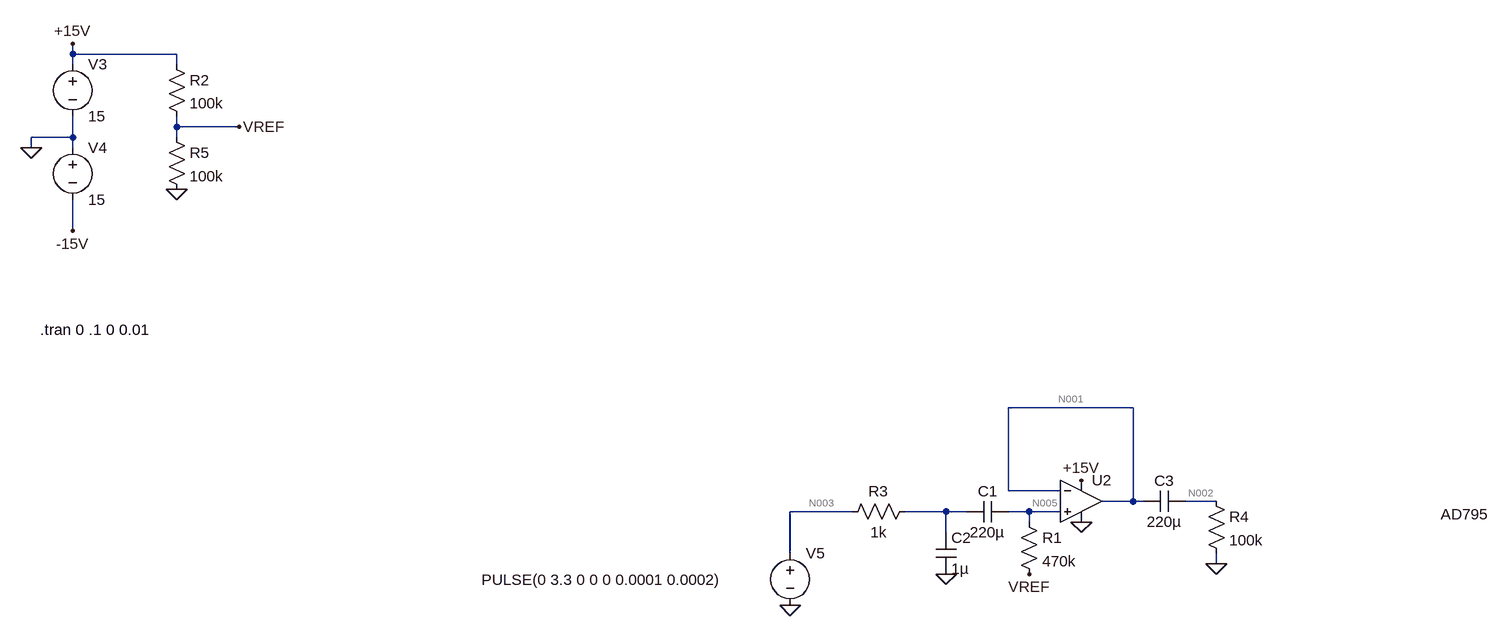
[diagram p0: schematic PWM_filtering.asc]
PWM_filtering.asc, the LTspice schematic file:
Version 4
SHEET 1 1688 996
WIRE -496 0 -496 -16
WIRE -336 0 -496 0
WIRE -496 16 -496 0
WIRE -336 16 -336 0
WIRE -336 112 -336 96
WIRE -240 112 -336 112
WIRE -496 128 -496 96
WIRE -496 128 -560 128
WIRE -336 128 -336 112
WIRE -560 144 -560 128
WIRE -496 144 -496 128
WIRE -496 272 -496 224
WIRE 1136 544 944 544
WIRE 944 672 944 544
WIRE 1024 672 944 672
WIRE 1136 688 1136 544
WIRE 1136 688 1088 688
WIRE 1152 688 1136 688
WIRE 1264 688 1216 688
WIRE 704 704 608 704
WIRE 848 704 784 704
WIRE 880 704 848 704
WIRE 976 704 944 704
WIRE 1024 704 976 704
WIRE 976 720 976 704
WIRE 848 736 848 704
WIRE 608 768 608 704
WIRE 1264 784 1264 768
FLAG -560 144 0
FLAG -496 -16 +15V
FLAG -496 272 -15V
FLAG 608 848 0
FLAG 1056 656 +15V
FLAG 848 800 0
FLAG 1264 784 0
FLAG 1056 720 0
FLAG -336 208 0
FLAG -240 112 VREF
FLAG 976 800 VREF
SYMBOL voltage -496 0 R0
WINDOW 123 0 0 Left 0
WINDOW 39 0 0 Left 0
SYMATTR InstName V3
SYMATTR Value 15
SYMBOL voltage -496 128 R0
WINDOW 123 0 0 Left 0
WINDOW 39 0 0 Left 0
SYMATTR InstName V4
SYMATTR Value 15
SYMBOL voltage 608 752 R0
WINDOW 3 -475 57 Left 2
WINDOW 123 0 0 Left 0
WINDOW 39 0 0 Left 0
SYMATTR InstName V5
SYMATTR Value PULSE(0 3.3 0 0 0 0.0001 0.0002)
SYMBOL Opamps\\AD795 1056 624 R0
WINDOW 3 553 84 Left 2
SYMATTR InstName U2
SYMBOL cap 832 736 R0
SYMATTR InstName C2
SYMATTR Value 1µ
SYMBOL res 800 688 R90
WINDOW 0 0 56 VBottom 2
WINDOW 3 32 56 VTop 2
SYMATTR InstName R3
SYMATTR Value 1k
SYMBOL res 1248 672 R0
SYMATTR InstName R4
SYMATTR Value 100k
SYMBOL res 960 704 R0
SYMATTR InstName R1
SYMATTR Value 470k
SYMBOL res -352 0 R0
SYMATTR InstName R2
SYMATTR Value 100k
SYMBOL res -352 112 R0
SYMATTR InstName R5
SYMATTR Value 100k
SYMBOL cap 944 688 R90
WINDOW 0 0 32 VBottom 2
WINDOW 3 32 32 VTop 2
SYMATTR InstName C1
SYMATTR Value 220µ
SYMBOL cap 1216 672 R90
WINDOW 0 0 32 VBottom 2
WINDOW 3 32 32 VTop 2
SYMATTR InstName C3
SYMATTR Value 220µ
TEXT -546 424 Left 2 !.tran 0 .1 0 0.01

The netlist it stands for:
* PWM_filtering.asc
V3 +15V 0 15
V4 0 -15V 15
V5 N003 0 PULSE(0 3.3 0 0 0 0.0001 0.0002)
XU2 N005 N001 +15V 0 N001 AD795  ; pins In+ In- V+ V- OUT
C2 N004 0 1µ
R3 N004 N003 1k
R4 N002 0 100k
R1 N005 VREF 470k
R2 +15V VREF 100k
R5 VREF 0 100k
C1 N005 N004 220µ
C3 N002 N001 220µ
.tran 0 .1 0 0.01
.lib ADI1.lib
.backanno
.end

* Results of the author's LTspice run, read from the files saved beside the schematic
* Operating Point, zero values left out:
*   V(+15v) = 15 V
*   V(-15v) = -15 V
*   V(n005) = 7.5 V
*   V(n001) = 7.5 V
*   V(vref) = 7.5 V
*   I(R5) = 75 µA
*   I(R2) = 75 µA
*   I(R1) = 6.398 pA
*   I(V3) = -1.362 mA
*   Ix(u2:1) = -6.4 pA
*   Ix(u2:2) = -6.6 pA
*   Ix(u2:99) = 1.287 mA
*   Ix(u2:50) = -1.287 mA
*   Ix(u2:30) = 5.329 pA
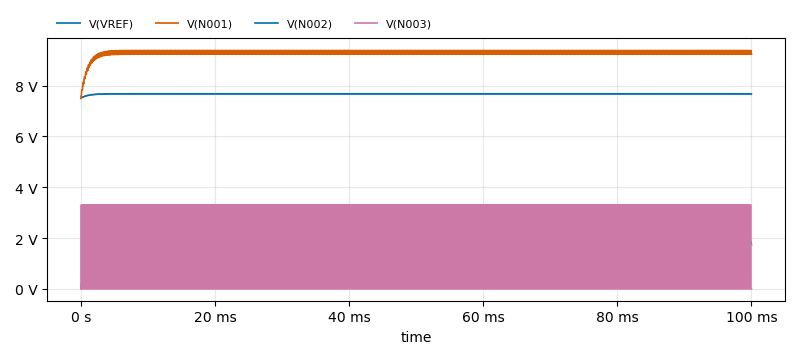
[diagram p1: Transient Analysis of PWM_filtering.asc, plotted from the saved traces]
* Transient Analysis, 1 run:
*   V(VREF): min 7.5 V, max 7.682 V, average 7.672 V, rms 7.672 V, last 7.667 V
*   V(N001): min 7.5 V, max 9.388 V, average 9.293 V, rms 9.294 V, last 9.237 V
*   V(N002): min 0 V, max 1.888 V, average 1.789 V, rms 1.795 V, last 1.729 V
*   V(N003): min 0 V, max 3.3 V, average 1.815 V, rms 2.419 V, last 0 V